# EAGLE design MAX_M10S (EAGLE 9.6.2)
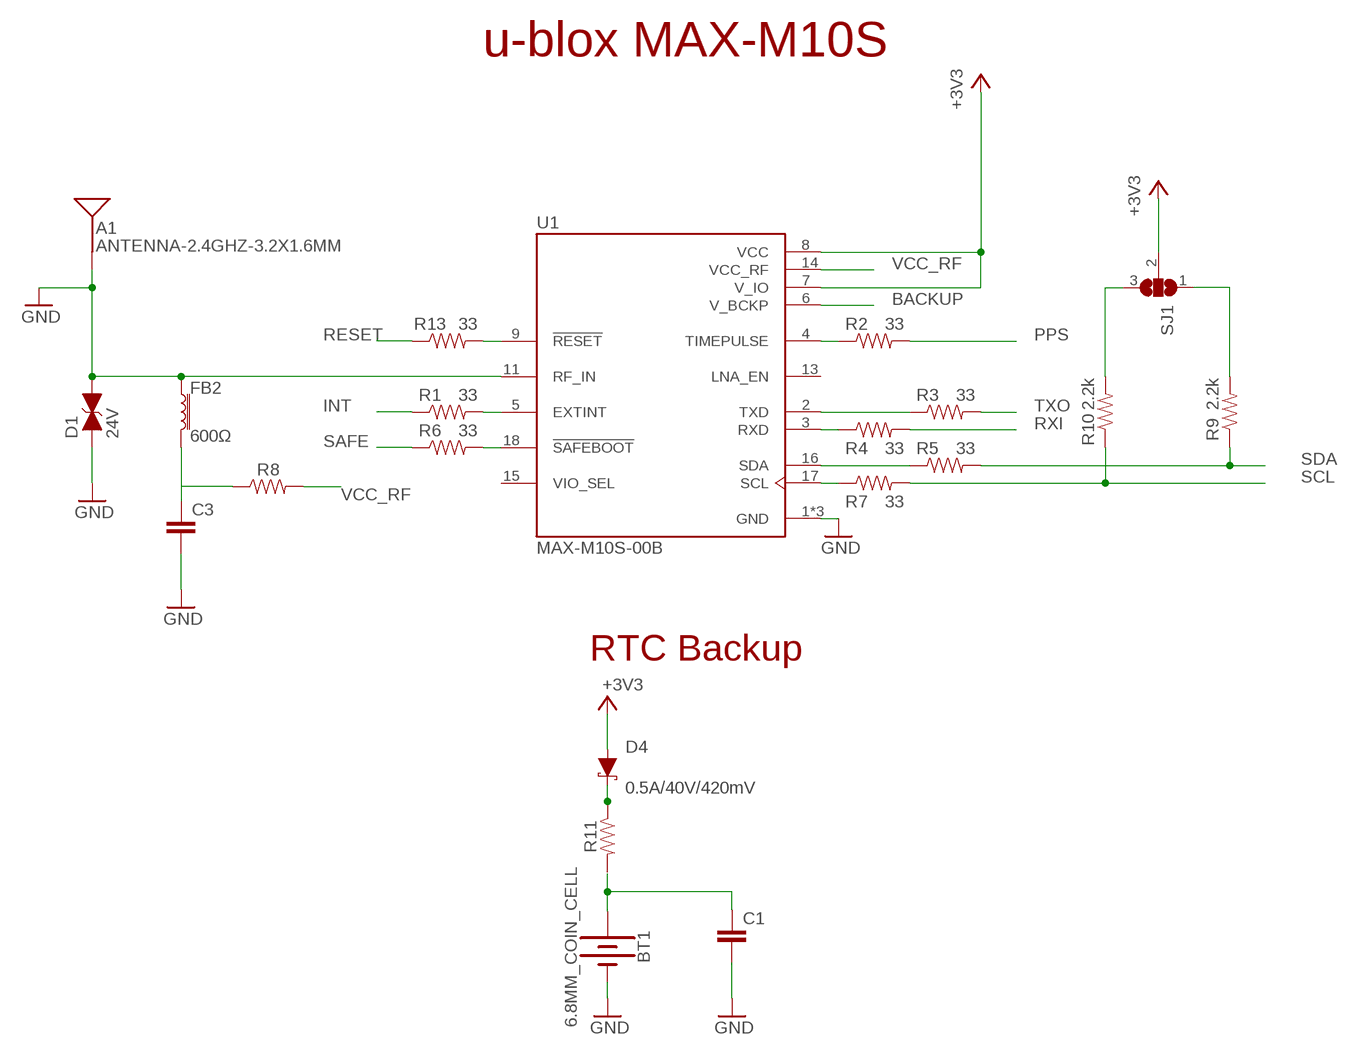
[diagram p0: schematic, sheet 1]

## Parts
A1  ANTENNA-2.4GHZ-3.2X1.6MM  [ANT-2.4GHZ-3.2X1.6X1.2MM]
BT1  6.8MM_COIN_CELL  BATTERY-6.8MM_SMD  [BATTCON-6.8MM]
C1  CAP-1206  [1206]
C3  CAP-1206  [1206]
D1  24V  DIODE_TVS  [0603]
D4  0.5A/40V/420mV  DIODE-SCHOTTKY-B340A  [SMA-DIODE]
FB2  600Ω  FERRITE_BEAD-0805-600Ω-100MHZ  [0805]
R1  33  RESISTOR1206  [1206]
R2  33  RESISTOR1206  [1206]
R3  33  RESISTOR1206  [1206]
R4  33  RESISTOR1206  [1206]
R5  33  RESISTOR1206  [1206]
R6  33  RESISTOR1206  [1206]
R7  33  RESISTOR1206  [1206]
R8  33  RESISTOR1206  [1206]
R9  2.2k  RESISTOR1206  [1206]
R10  2.2k  RESISTOR1206  [1206]
R11  33  RESISTOR1206  [1206]
R13  33  RESISTOR1206  [1206]
SJ1  SJ2W  [SJ_2]
U1  MAX-M10S-00B  [XCVR_MAX-M10S-00B]

## Nets
+3V3: D4.A SJ1.2
BACKUP: U1.6(V_BCKP)
GND: BT1.- C1.2 C3.2 D1.1(A) U1.1(GND) U1.10(GND) U1.12(GND)
INT: R1.1
N$1: R2.1 U1.4(TIMEPULSE)
N$2: R3.1 U1.2(TXD)
N$3: R4.1 U1.3(RXD)
N$4: R5.1 U1.16(SDA)
N$5: R7.1 U1.17(SCL)
N$6: R13.2 U1.9(!RESET)
N$7: R1.2 U1.5(EXTINT)
N$8: R6.2 U1.18(!SAFEBOOT)
N$9: R10.2 SJ1.3
N$10: R9.2 SJ1.1
N$11: A1.FEED(SIGNAL) D1.2(C) FB2.1 U1.11(RF_IN) ; supply symbol labelled GND
N$12: C3.1 FB2.2 R8.1
N$13: BT1.+ C1.1
N$14: D4.C R11.1
PPS: R2.2
RESET: R13.1
RXI: R4.2
SAFE: R6.1
SCL: R7.2 R10.1
SDA: R5.2 R9.1
SPPLY1: U1.7(V_IO) U1.8(VCC) ; supply symbol labelled +3V3
TXO: R3.2
VCC_RF: R8.2 U1.14(VCC_RF)
Unconnected: R11.2 U1.13(LNA_EN) U1.15(VIO_SEL)

## Notes on the sheet
- u-blox MAX-M10S
- RTC Backup

## Library data of the parts
A1 = SparkFun-RF:ANTENNA: Single-ended Antennae 2.4GHz and antennae with just one terminal. These are all chip antennae. 2.4GHz (WiFi/BT/ZigBee) Antennae ANT-2.4GHZ-6.5X2.2MM - 6.5 x 2.2 mm chip antenna. (SparkFun Product <https://www.sparkfun.com/products/144>) ANT-2.4GHZ8.0X1.0MM - 8.0 x 1.0 mm chip antenna. (Datasheet <http://www.mouser.com/ds/2/611/antenna_2500at44m0400-242425.pdf>) ANT-2.4GHZ9.5X2.0MM - 9.5 x 2.0 mm chip antenna. (SparkFun Product <https://www.sparkfun.com/products/9025>); PROD_ID: ANT-14235
BT1 = SparkFun-Batteries:BATTERY: Battery - Single Cell A variety of battery chemistries, sizes, and footprints. Device List: 20MM_PTH - Coin Cell Battery Holder - 20mm (PTH) <https://www.sparkfun.com/products/783> 20MM_PTH_KIT- Coin Cell battery Holder - 20 mm (PTH) <http://www.sparkfun.com/products/783>kit version with special mask 6.8MM_PTH - Coin Cell Battery Holder - 6.8MM(SMD) <https://www.digikey.com/product-detail/en/seiko-instruments/MS621FE-FL11E/728-1057-ND/1889208?WT.srch=1&gclid=CNOQ5a6LzdQCFZS2wAodXCkE0g> 12MM_SMD - Coin Cell Battery Holder - 12mm (SMD) <https://www.sparkfun.com/products/10592> 12MM_PTH - Coin Cell Battery Holder - 12mm (PTH) <https://www.sparkfun.com/products/7948> 20MM_SMD - 20mm Coin Cell Battery Holder (SMD) (2 legs) Used on the Big Time Watch Kit <https://www.sparkfun.com/products/11734> 20MM_SMD_4LEGS - Coin Cell Battery Holder - 20mm (SMD) <https://www.sparkfun.com/products/11892> 20MM_SMD_4LEGS_OVERPASTE - Coin Cell Battery Holder - 20mm (SMD) <https://www.sparkfun.com/products/11892> (Over-paste on the legs) 24.5MM_PTH - Coin Cell Battery Holder - 24.5mm (PTH) <https://www.sparkfun.com/products/8863> 9V - 9V Battery Holder - PC Mount Used on the SparkFun SparkPunk Sound Kit <https://www.sparkfun.com/products/11177> and SparkFun SparkPunk Sequencer Kit <https://www.sparkfun.com/products/12707> 18650 - Battery Holder - 18650 (PTH) <https://www.sparkfun.com/products/13113> AA - Battery Holder - 1xAA (PTH) <https://www.sparkfun.com/products/7949> AAA - Battery Holder - 1xAAA (PTH) <https://www.sparkfun.com/products/12718> AA_KIT - Battery Holder - 1xAA (PTH) <https://www.sparkfun.com/products/7949> Special kit package - pads only have exposed copper on one side of the board. AAA_KIT - Battery Holder - 1xAAA (PTH) <https://www.sparkfun.com/products/12718> Special kit package - pads only have exposed copper on one side of the board.; PROD_ID: BATT-13734
C1 C3 = SparkFun-Capacitors:CAP
D1 = SparkFun-DiscreteSemi:DIODE_TVS; PROD_ID: DIO-14502
D4 = SparkFun-DiscreteSemi:DIODE-SCHOTTKY: Schottky diode A Schottky diode is a semiconductor diode which has a low forward voltage drop and a very fast switching action.; PROD_ID: DIO-09886; VALUE: 3A/40V/500mV
FB2 = SparkFun-Coils:FERRITE_BEAD: Ferrite Bead (blocks, cores, rings, chokes, etc.) Inductor with layers of ferrite used to suppress high frequencies. Often used to isolate high frequency noise. SparkFun Products: IOIO-OTG - V2.2 <https://www.sparkfun.com/products/13613> SparkFun SAMD21 Mini Breakout <https://www.sparkfun.com/products/13664> SparkFun 6 Degrees of Freedom Breakout - LSM6DS3 <https://www.sparkfun.com/products/13339> SparkFun SAMD21 Dev Breakout <https://www.sparkfun.com/products/13672> Lilypad MP3 <https://www.sparkfun.com/products/11013>; PROD_ID: NDUC-14988
R1-R11 R13 = SparkFun-Resistors:RESISTOR: Generic Resistor Package
SJ1 = jumper:SJ2W: SMD solder JUMPER
U1 = MAX-M10S-00B:MAX-M10S-00B: Check availability <https://pricing.snapeda.com/parts/MAX-M10S-00B/U-Blox/view-part?ref=eda>; AVAILABILITY: In Stock; CHECK_PRICES: https://www.snapeda.com/parts/MAX-M10S-00B/u-blox/view-part/?ref=eda; DESCRIPTION: Navigation BeiDou, Galileo, GLONASS, GPS, GNSS Transceiver Module 1.561GHz, 1.575GHz, 1.602GHz Antenna Not Included Surface Mount; MF: U-Blox; MP: MAX-M10S-00B; PACKAGE: SMD-18 u-blox; PRICE: None; SNAPEDA_LINK: https://www.snapeda.com/parts/MAX-M10S-00B/u-blox/view-part/?ref=snap

## Board
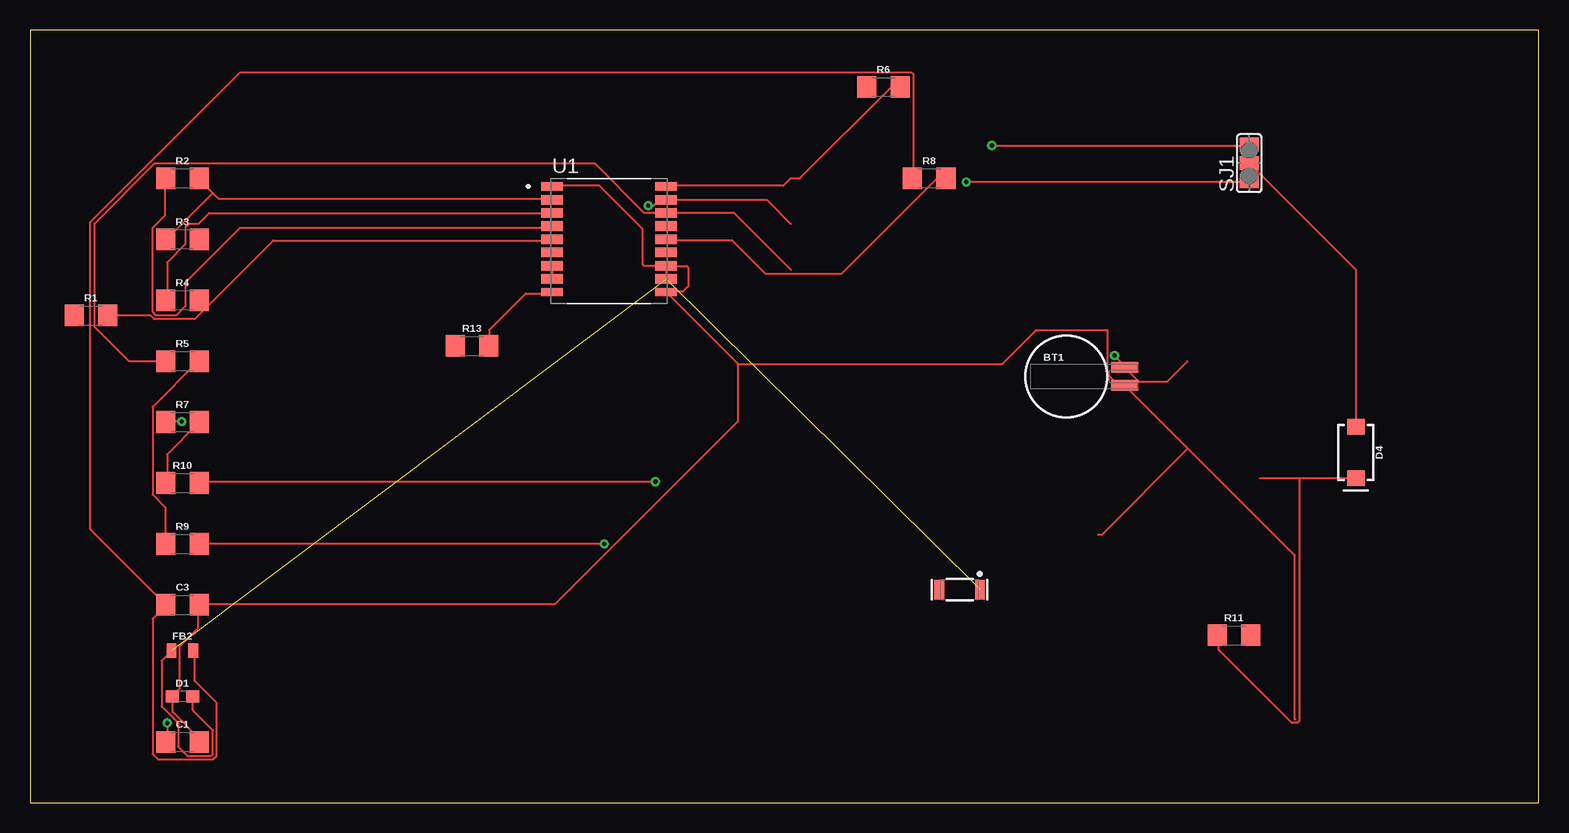
[diagram p1: board, top side]
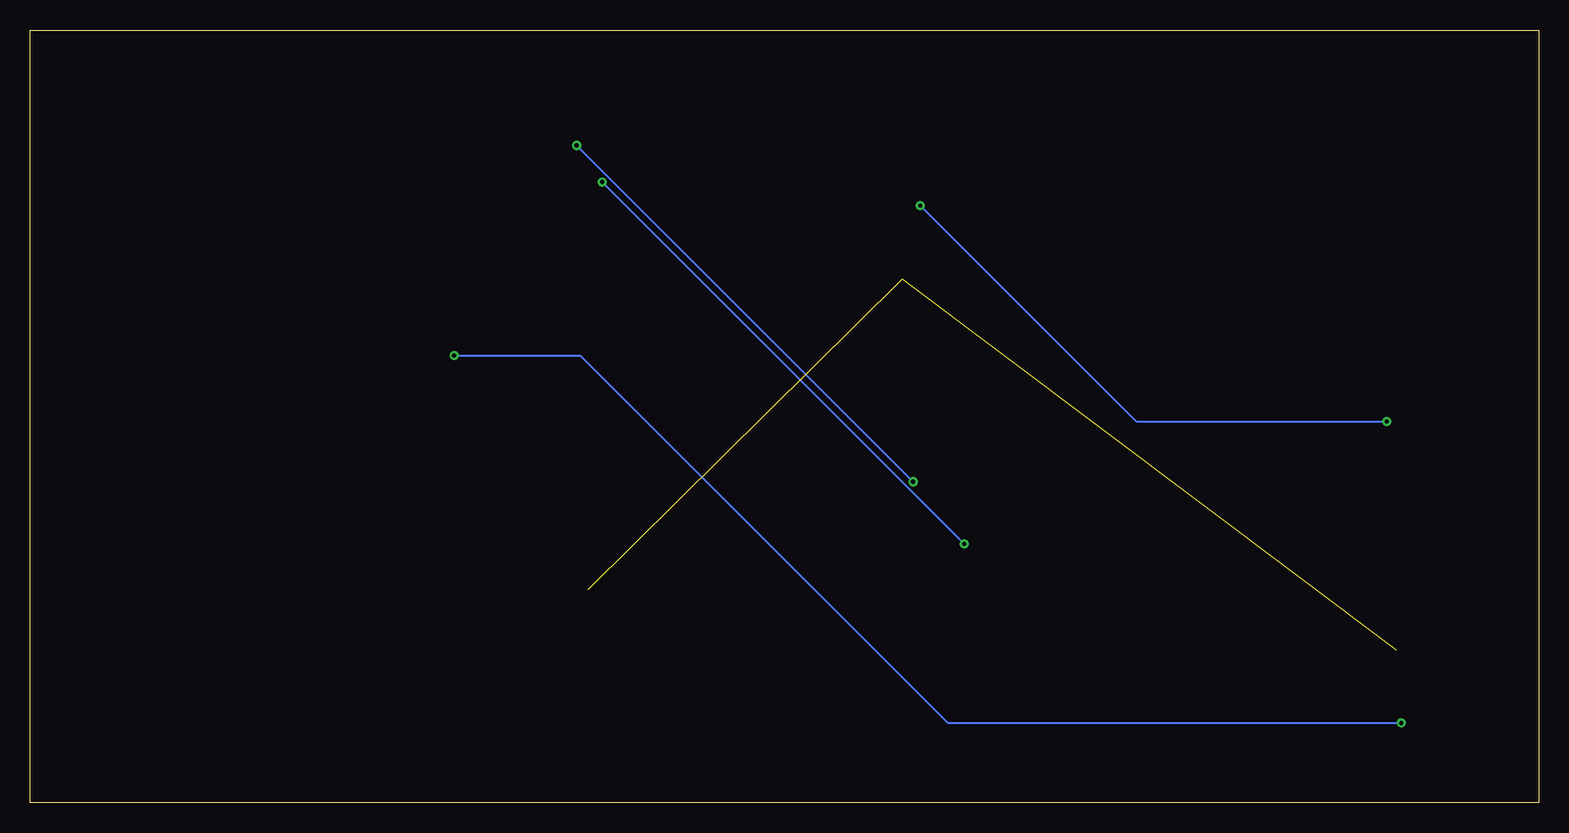
[diagram p2: board, bottom side, seen from below]

Size 125.71 x 64.44 mm. Coordinates in mm from the lower left corner, seen from the top.
Outline: 0,0 125.71,0 125.71,64.44 0,64.44 0,0
Copper layers (1*16): Top 0.035mm / dielectric 1.5mm / Bottom 0.035mm
Design rules "default": minimum track width 6mil, minimum drill 0.35mm, track to track 6mil, track to pad 6mil, pad to pad 6mil, via to via 6mil, smd to smd 6mil, copper to edge 40mil, drill to drill 6mil, minimum pad ring 10mil, minimum via ring 8mil, stop-mask expansion 4mil, vias tented up to drill 0mil, thermal gap 10mil

### Footprints (pad centres in the part's own frame; a part is rotated, then mirrored left to right if it is on the bottom)
ANT-2.4GHZ-3.2X1.6X1.2MM = smd 0.8 x 1.6: FEED -1.7,0; NC 1.7,0
BATTCON-6.8MM = smd 2.25 x 0.85: + 4.87,0.75; - 4.87,-0.75
1206 = smd 1.6 x 1.8: 1 -1.4,0; 2 1.4,0
0603 = smd 1.1 x 1: 1 -0.85,0; 2 0.85,0
SMA-DIODE = smd 1.27 x 1.47: A -2.15,0; C 2.15,0
0805 = smd 0.8 x 1.2: 1 -0.9,0; 2 0.9,0
SJ_2 = smd 1.168 x 1.6: 1 -1.524,0; 2 0,0; 3 1.524,0
XCVR_MAX-M10S-00B = smd 1.8 x 0.7: 1 -4.75,4.4; 9 -4.75,-4.4; 10 4.75,-4.4; 18 4.75,4.4 | smd 1.8 x 0.8: 2 -4.75,3.3; 3 -4.75,2.2; 4 -4.75,1.1; 5 -4.75,0; 6 -4.75,-1.1; 7 -4.75,-2.2; 8 -4.75,-3.3; 11 4.75,-3.3; 12 4.75,-2.2; 13 4.75,-1.1; 14 4.75,0; 15 4.75,1.1; 16 4.75,2.2; 17 4.75,3.3

### Placement (x,y rotation side)
A1  77.47,17.78 180 top
BT1  86.36,35.56 0 top
C1  12.7,5.08 0 top
C3  12.7,16.51 0 top
D1  12.7,8.89 0 top
D4  110.49,29.21 270 top
FB2  12.7,12.7 0 top
R1  5.08,40.64 0 top
R2  12.7,52.07 0 top
R3  12.7,46.99 0 top
R4  12.7,41.91 0 top
R5  12.7,36.83 0 top
R6  71.12,59.69 0 top
R7  12.7,31.75 0 top
R8  74.93,52.07 0 top
R9  12.7,21.59 0 top
R10  12.7,26.67 0 top
R11  100.33,13.97 0 top
R13  36.83,38.1 0 top
SJ1  101.6,53.34 90 top
U1  48.26,46.99 0 top

### Tracks (layer width: path | path; a pad name or v marks a point on that pad's centre or on a via)
+3V3
  Top 0.152: SJ1.2 110.49,44.45 D4.A
GND
  Top 0.152: 89.76,39.37 83.82,39.37 81.03,36.58 59.02,36.58 | 96.5,29.54 BT1.- 91.13,34.85 90.68,34.85 89.76,35.76 89.76,39.37 | 96.5,29.54 105.41,20.63 105.41,6.96 105.46,6.96 | 53.04,44.76 54.71,44.76 54.86,44.6 54.86,43.08 54.41,42.62 53.04,42.62 U1.10 59.02,36.58 | U1.1 43.59,51.46 47.45,51.46 51.05,47.85 51.05,44.91 51.21,44.76 52.88,44.76 U1.12 53.04,44.76 | 89.76,39.42 89.76,39.37 | 89,22.35 89.31,22.35 96.5,29.54 | 53.04,44.76 53.04,43.84 | C1.2 14.02,5.13 14.02,5.44 11.89,7.57 11.89,8.79 D1.1 11.89,8.94 12.5,9.55 12.5,13.06 14.02,14.58 14.02,16.41 C3.2 14.17,16.56 43.74,16.56 58.98,31.8 58.98,36.52 59.02,36.58
N$1
  Top 0.152: U1.4 43.43,47.96 17.53,47.96 12.95,43.38 12.95,41.4 12.19,40.64 10.52,40.64 10.21,40.95 10.21,47.96 11.28,49.02 11.28,52.07 R2.1
N$2
  Top 0.152: 14.02,52.07 15.24,50.85 | 15.24,50.85 15.7,50.39 43.43,50.39 U1.2 | 15.24,50.85 11.43,47.04 R3.1
N$3
  Top 0.152: U1.3 43.43,49.17 14.94,49.17 14.02,48.26 13.26,48.26 12.95,47.96 12.95,46.58 11.43,45.06 11.43,42.01 R4.1
N$4
  Top 0.152: 63.4,44.45 58.67,49.17 53.04,49.17 U1.16 52.88,49.17 51.21,49.17 47.09,53.29 10.36,53.29 5.33,48.26 5.33,39.73 8.23,36.83 R5.1
N$5  (via drill 0.35)
  Top 0.152: 63.4,48.26 61.42,50.24 53.04,50.24 U1.17 52.88,50.24 52.43,50.24 51.97,49.78 v51.51,49.78 | v12.65,31.8 11.43,31.8 R7.1
  Bottom 0.152: v12.65,31.8 33.53,31.8 v51.51,49.78
N$6
  Top 0.152: U1.9 43.43,42.47 41.3,42.47 38.25,39.42 38.25,38.2 R13.2
N$7
  Top 0.152: U1.5 43.43,46.89 20.27,46.89 13.72,40.34 10.36,40.34 10.06,40.64 R1.2
N$8
  Top 0.152: U1.18 53.04,51.46 62.79,51.46 63.4,52.07 64.16,52.07 71.78,59.69 R6.2
N$9  (via drill 0.35)
  Top 0.152: v80.16,54.81 101.5,54.81 SJ1.3 | v52.12,26.77 14.17,26.77 R10.2
  Bottom 0.152: v80.16,54.81 v52.12,26.77
N$10  (via drill 0.35)
  Top 0.152: SJ1.1 101.5,51.76 v78.03,51.76 | v47.85,21.59 R9.2
  Bottom 0.152: v78.03,51.76 v47.85,21.59
N$11  (2 unrouted)
  Top 0.152: D1.2 13.56,8.79 13.56,7.72 15.24,6.04 15.24,4.06 15.09,3.91 13.11,3.91 12.34,4.67 12.34,6.66 10.97,8.03 10.97,11.84 11.73,12.6 FB2.1
N$12
  Top 0.152: FB2.2 13.72,12.6 13.72,10.16 15.55,8.33 15.55,3.91 15.24,3.61 10.67,3.61 10.21,4.06 10.21,15.34 11.28,16.41 C3.1 11.28,16.56 5.03,22.81 5.03,48.41 17.53,60.91 73.46,60.91 73.61,60.76 73.61,52.07 R8.1
N$13  (via drill 0.35)
  Top 0.152: 96.47,36.83 94.74,35.1 92.44,35.1 BT1.+ 91.29,36.37 v90.37,37.29 | v11.43,6.66 11.43,5.13 C1.1
  Bottom 0.152: v11.43,6.66 49.23,6.66 79.86,37.29 v90.37,37.29
N$14
  Top 0.152: D4.C 105.77,27.06 | 105.77,27.06 102.48,27.06 | 105.77,27.06 105.77,6.81 105.61,6.66 105.16,6.66 99.06,12.75 99.06,13.97 R11.1 | 105.77,27.08 105.77,27.06
SCL
  Top 0.152: R10.1 11.43,26.77 11.43,29.06 14.02,31.65 R7.2
SDA
  Top 0.152: R9.1 11.28,21.59 11.28,24.64 10.21,25.7 10.21,33.02 14.02,36.83 R5.2
SPPLY1
  Top 0.152: U1.7 U1.8
VCC_RF
  Top 0.152: U1.14 53.04,46.89 58.52,46.89 61.27,44.15 67.67,44.15 75.59,52.07 R8.2